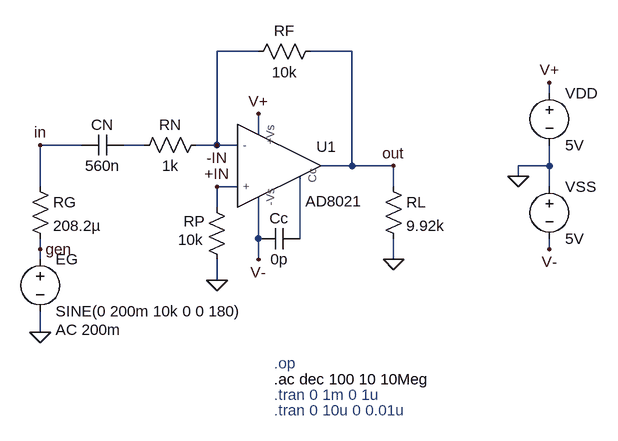
[diagram p0: schematic stage_3.asc]
stage_3.asc, the LTspice schematic file:
Version 4
SHEET 1 1116 792
WIRE 192 0 128 0
WIRE 336 0 272 0
WIRE 640 64 640 48
WIRE 192 128 192 96
WIRE -80 144 -144 144
WIRE 16 144 -16 144
WIRE 128 144 128 0
WIRE 128 144 96 144
WIRE 160 144 128 144
WIRE 336 176 336 0
WIRE 336 176 288 176
WIRE 400 176 336 176
WIRE 640 176 640 144
WIRE 640 176 592 176
WIRE 592 192 592 176
WIRE -144 208 -144 144
WIRE 160 208 128 208
WIRE 400 208 400 176
WIRE 640 208 640 176
WIRE 128 240 128 208
WIRE 192 288 192 224
WIRE 256 288 256 192
WIRE -144 304 -144 288
WIRE 640 304 640 288
WIRE -144 320 -144 304
WIRE 192 320 192 288
WIRE 400 320 400 288
WIRE 128 352 128 320
WIRE -144 432 -144 400
FLAG 592 192 0
FLAG 640 48 V+
FLAG 192 96 V+
FLAG 192 320 V-
FLAG 640 304 V-
FLAG -144 144 in
FLAG -144 432 0
FLAG 400 320 0
FLAG 400 176 out
FLAG 128 144 -IN
FLAG 128 208 +IN
FLAG 128 352 0
FLAG -144 304 gen
SYMBOL AutoGenerated\\AD8021 224 176 R0
WINDOW 0 73 -14 Bottom 2
WINDOW 3 84 39 Top 2
SYMATTR InstName U1
SYMBOL voltage 640 48 R0
SYMATTR InstName VDD
SYMATTR Value 5V
SYMBOL voltage 640 192 R0
SYMATTR InstName VSS
SYMATTR Value 5V
SYMBOL cap 256 272 R90
WINDOW 0 0 32 VBottom 2
WINDOW 3 32 32 VTop 2
SYMATTR InstName Cc
SYMATTR Value 0p
SYMBOL res 288 -16 R90
WINDOW 0 0 56 VBottom 2
WINDOW 3 32 56 VTop 2
SYMATTR InstName RF
SYMATTR Value 10k
SYMBOL res 112 128 R90
WINDOW 0 0 56 VBottom 2
WINDOW 3 32 56 VTop 2
SYMATTR InstName RN
SYMATTR Value 1k
SYMBOL voltage -144 304 R0
WINDOW 123 24 124 Left 2
WINDOW 39 0 0 Left 0
SYMATTR Value2 AC 200m
SYMATTR InstName EG
SYMATTR Value SINE(0 200m 10k 0 0 180)
SYMBOL cap -16 128 R90
WINDOW 0 0 32 VBottom 2
WINDOW 3 32 32 VTop 2
SYMATTR InstName CN
SYMATTR Value 560n
SYMBOL res 112 224 R0
WINDOW 0 -35 37 Left 2
WINDOW 3 -44 66 Left 2
SYMATTR InstName RP
SYMATTR Value 10k
SYMBOL res 384 192 R0
SYMATTR InstName RL
SYMATTR Value 9.92k
SYMBOL res -160 192 R0
SYMATTR InstName RG
SYMATTR Value 208.2µ
TEXT 216 528 Left 2 ;.tran 0 1m 0 1u
TEXT 216 504 Left 2 !.ac dec 100 10 10Meg
TEXT 216 480 Left 2 ;.op
TEXT 216 552 Left 2 ;.tran 0 10u 0 0.01u

The netlist it stands for:
* stage_3.asc
XU1 +IN -IN V+ V- out N002 AD8021  ; pins + - +Vs -Vs OUT Cc
VDD V+ 0 5V
VSS 0 V- 5V
Cc N002 V- 0p
RF out -IN 10k
RN -IN N001 1k
V§EG gen 0 SINE(0 200m 10k 0 0 180) AC 200m
CN N001 in 560n
RP +IN 0 10k
RL out 0 9.92k
RG in gen 208.2µ
* .tran 0 1m 0 1u
.ac dec 100 10 10Meg
* .op
* .tran 0 10u 0 0.01u
.lib Z:\home\pesho\data\Electronics\asht-kr\simulations\ad8021.cir
.backanno
.end